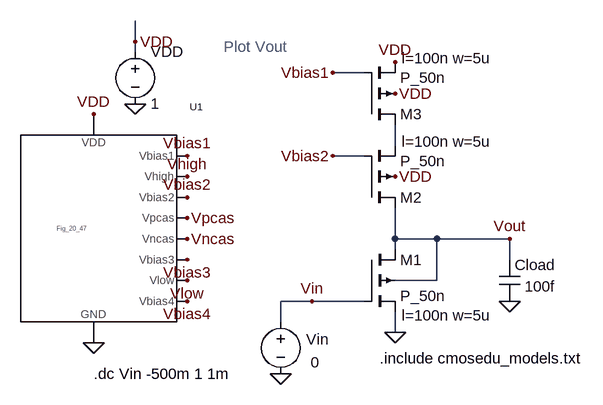
[diagram p0: schematic Fig21_42.asc]
Fig21_42.asc, the LTspice schematic file:
Version 4
SHEET 1 1680 680
WIRE 864 -352 864 -384
WIRE 864 -336 864 -352
WIRE 1216 -304 1168 -304
WIRE 1264 -192 1264 -224
WIRE 1216 -176 1168 -176
WIRE 1264 -48 1264 -96
WIRE 1328 -48 1264 -48
WIRE 1440 -48 1328 -48
WIRE 1264 -32 1264 -48
WIRE 1440 -16 1440 -48
WIRE 1328 16 1328 -48
WIRE 1328 16 1264 16
WIRE 1136 48 1088 48
WIRE 1216 48 1136 48
WIRE 1088 80 1088 48
WIRE 1264 96 1264 64
FLAG 864 -256 0
FLAG 864 -352 VDD
FLAG 1440 48 0
FLAG 1264 -320 VDD
FLAG 1264 -272 VDD
FLAG 1264 -144 VDD
FLAG 1168 -304 Vbias1
FLAG 1168 -176 Vbias2
FLAG 800 -240 VDD
FLAG 800 112 0
FLAG 944 -176 Vbias1
FLAG 944 -144 Vhigh
FLAG 944 -112 Vbias2
FLAG 944 -16 Vbias3
FLAG 944 -80 Vpcas
FLAG 944 -48 Vncas
FLAG 944 48 Vbias4
FLAG 944 16 Vlow
FLAG 1088 160 0
FLAG 1440 -48 Vout
FLAG 1264 96 0
FLAG 1136 48 Vin
SYMBOL voltage 864 -352 R0
WINDOW 123 0 0 Left 2
WINDOW 39 0 0 Left 2
SYMATTR InstName VDD
SYMATTR Value 1
SYMBOL pmos4 1216 -224 M180
WINDOW 123 58 102 Left 2
WINDOW 0 56 16 Left 2
SYMATTR Value2 l=100n w=5u
SYMATTR InstName M3
SYMATTR Value P_50n
SYMBOL pmos4 1216 -96 M180
WINDOW 123 58 102 Left 2
WINDOW 0 56 16 Left 2
SYMATTR Value2 l=100n w=5u
SYMATTR InstName M2
SYMATTR Value P_50n
SYMBOL Fig_20_47 800 -64 R0
SYMATTR InstName U1
SYMBOL cap 1424 -16 R0
WINDOW 3 39 41 Left 2
SYMATTR Value 100f
SYMATTR InstName Cload
SYMBOL voltage 1088 64 R0
WINDOW 0 39 43 Left 2
WINDOW 123 38 75 Left 2
WINDOW 39 0 0 Left 2
WINDOW 3 46 78 Left 2
SYMATTR InstName Vin
SYMATTR Value 0
SYMBOL pmos4 1216 -32 R0
WINDOW 123 58 102 Left 2
WINDOW 0 56 16 Left 2
SYMATTR Value2 l=100n w=5u
SYMATTR InstName M1
SYMATTR Value P_50n
TEXT 1240 136 Left 2 !.include cmosedu_models.txt
TEXT 1000 -344 Left 2 ;Plot Vout
TEXT 800 160 Left 2 !.dc Vin -500m 1 1m

The netlist it stands for:
* Fig21_42.asc
VDD VDD 0 1
M3 N001 Vbias1 VDD VDD P_50n l=100n w=5u
M2 Vout Vbias2 N001 VDD P_50n l=100n w=5u
XU1 Vbias1 Vhigh Vbias2 Vpcas Vncas Vbias3 Vlow Vbias4 VDD 0 Fig_20_47  ; pins Vbias1 Vhigh Vbias2 Vpcas Vncas Vbias3 Vlow Vbias4 VDD GND
Cload Vout 0 100f
Vin Vin 0 0
M1 Vout Vin 0 Vout P_50n l=100n w=5u
.model NMOS NMOS
.model PMOS PMOS
.lib standard.mos
.include cmosedu_models.txt
* Plot Vout
.dc Vin -500m 1 1m
.backanno
.end